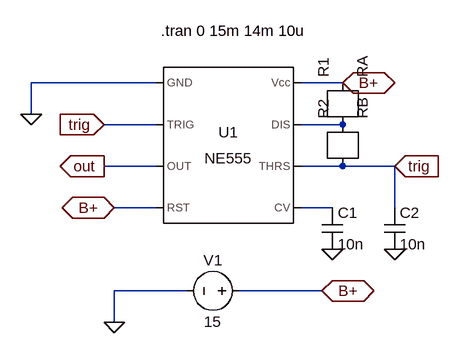
[diagram p0: schematic lab_ele_4.asc]
lab_ele_4.asc, the LTspice schematic file:
Version 4
SHEET 1 880 768
WIRE 304 256 112 256
WIRE 592 256 528 256
WIRE 112 304 112 256
WIRE 304 320 224 320
WIRE 592 320 528 320
WIRE 304 384 224 384
WIRE 592 384 528 384
WIRE 672 384 592 384
WIRE 304 448 240 448
WIRE 576 448 528 448
WIRE 672 448 672 384
WIRE 352 576 240 576
WIRE 560 576 432 576
WIRE 240 624 240 576
FLAG 112 304 0
FLAG 240 624 0
FLAG 560 576 B+
IOPIN 560 576 BiDir
FLAG 240 448 B+
IOPIN 240 448 BiDir
FLAG 592 256 B+
IOPIN 592 256 BiDir
FLAG 224 320 trig
IOPIN 224 320 In
FLAG 224 384 out
IOPIN 224 384 Out
FLAG 576 512 0
FLAG 672 512 0
FLAG 672 384 trig
IOPIN 672 384 In
SYMBOL NE555 416 352 R0
SYMATTR InstName U1
SYMBOL voltage 448 576 R90
WINDOW 0 -32 56 VBottom 2
WINDOW 3 32 56 VTop 2
SYMATTR InstName V1
SYMATTR Value 15
SYMBOL r 592 320 R270
SYMATTR InstName R1
SYMATTR Value RA
SYMBOL r 592 384 R270
SYMATTR InstName R2
SYMATTR Value RB
SYMBOL cap 560 448 R0
SYMATTR InstName C1
SYMATTR Value 10n
SYMBOL cap 656 448 R0
SYMATTR InstName C2
SYMATTR Value 10n
TEXT 312 176 Left 2 !.tran 0 15m 14m 10u

The netlist it stands for:
* lab_ele_4.asc
XU1 0 trig out B+ N002 trig N001 B+ NE555  ; pins GND TRIG OUT RST CV THRS DIS Vcc
V1 B+ 0 15
R1 B+ N001 RA
R2 N001 trig RB
C1 N002 0 10n
C2 trig 0 10n
.tran 0 15m 14m 10u
.lib NE555.sub
.backanno
.end